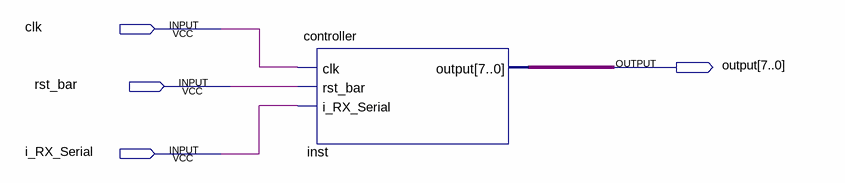
[diagram p0: schematic sheet]
// Quartus schematic ReceptionTest1.bdf as structural Verilog: 1 symbols, 4 pins
module ReceptionTest1 (
  input  clk,
  input  rst_bar,
  input  i_RX_Serial,
  output [7:0] \output 
);

  controller inst (.clk(clk), .rst_bar(rst_bar), .i_RX_Serial(i_RX_Serial), .\output (\output ));
endmodule
